# EAGLE design +6V (EAGLE 6.5.0)
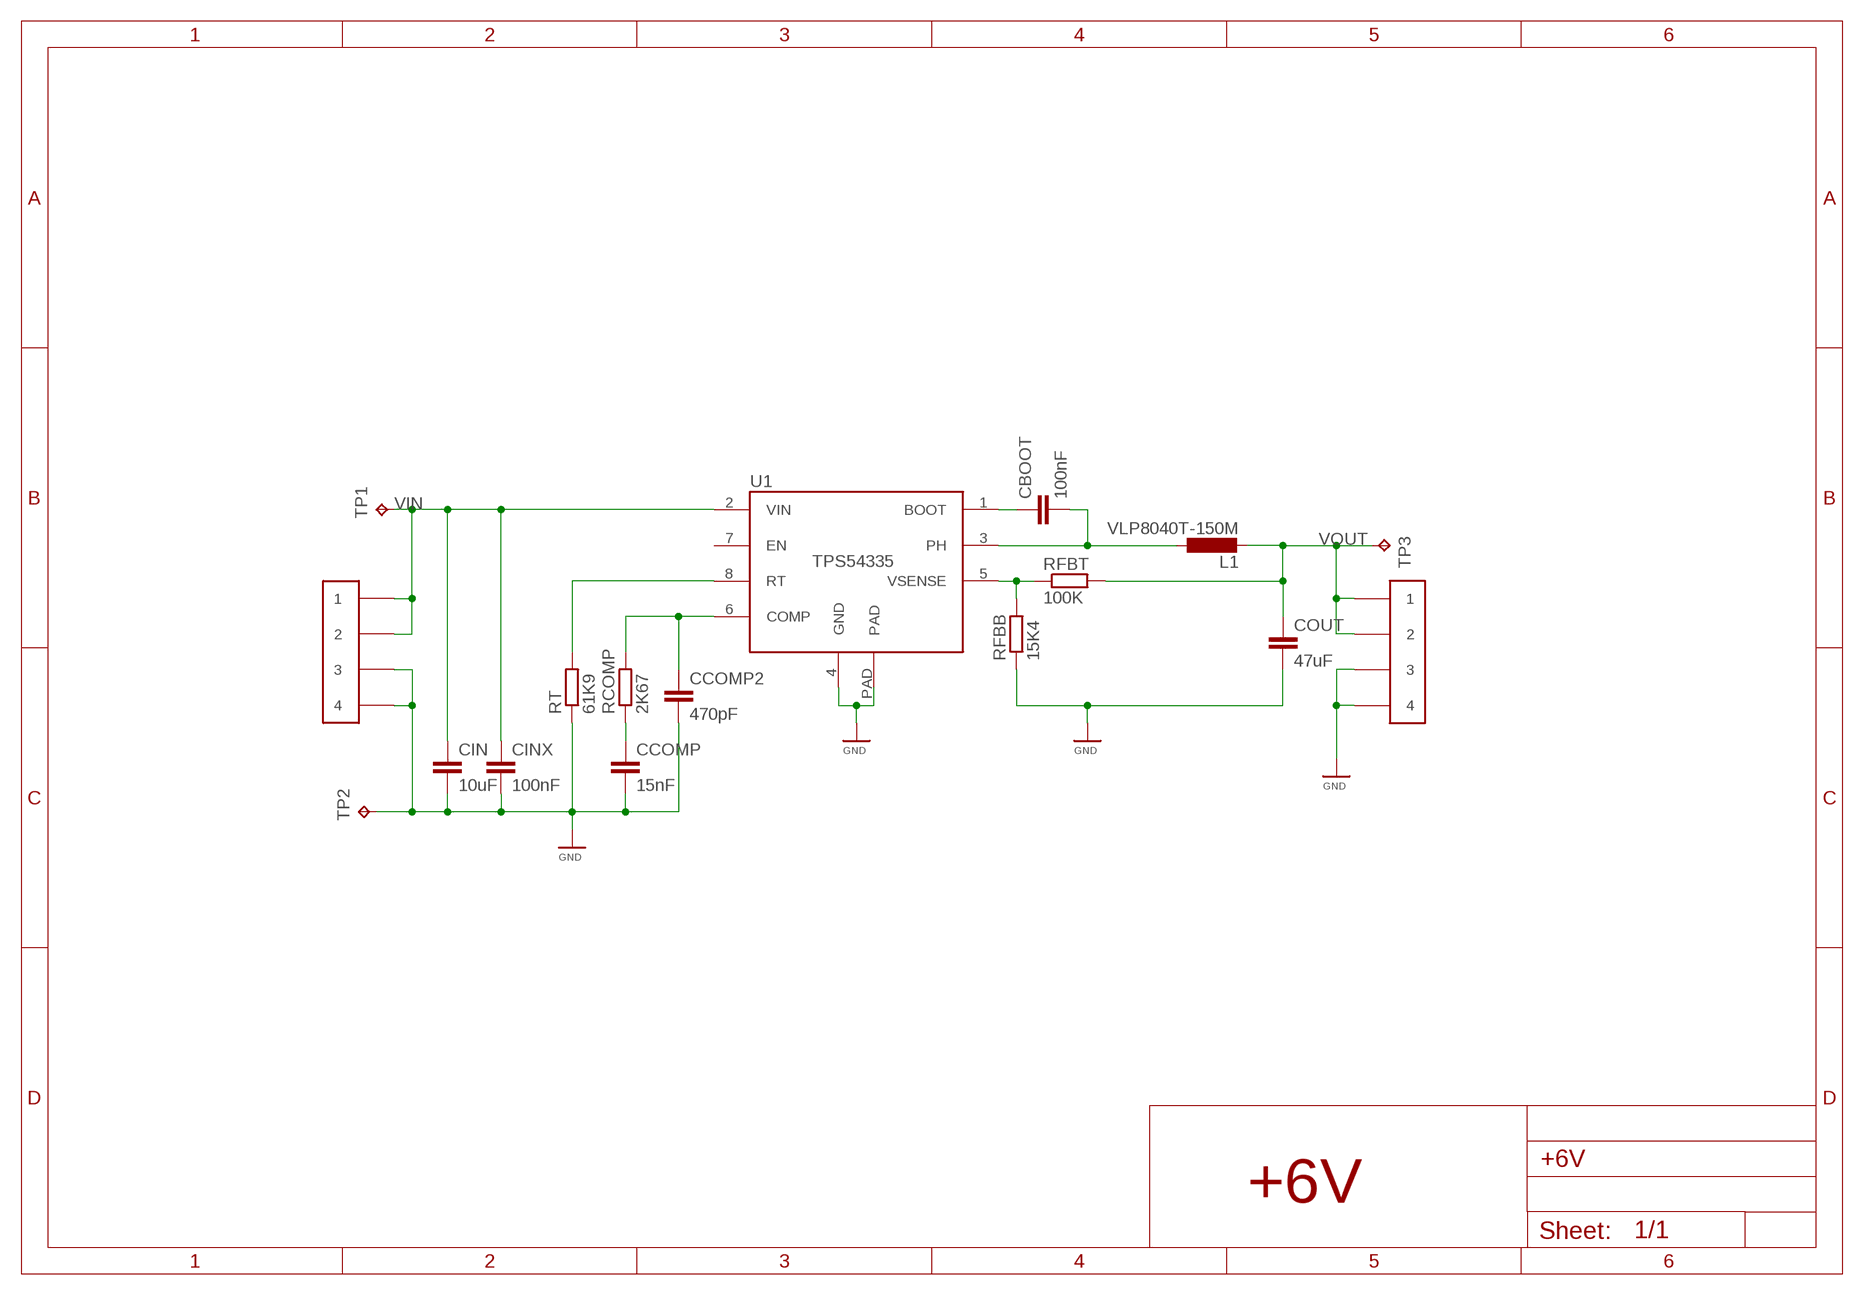
[diagram p0: schematic, sheet 1]
FRAME1 (FRAME): EXCLUDE_FROM_BOM: YES

## Parts
CBOOT  100nF  C0603  [C0603]
CCOMP  15nF  C0603  [C0603]
CCOMP2  470pF  C0603  [C0603]
CIN  10uF  C1210  [C1210]
CINX  100nF  C0603  [C0603]
COUT  47uF  C1812  [C1812]
L1  VLP8040T-150M  LTDK-VLP8040  [BOURNS-SDR1006]
RCOMP  2K67  R0603  [R0603]
RFBB  15K4  R0603  [R0603]
RFBT  100K  R0603  [R0603]
RT  61K9  R0603  [R0603]
TP1  TP  [TESTPAD]
TP2  TP  [TESTPAD]
TP3  TP  [TESTPAD]
U1  TPS54335  [TPS54335]
X1  PINCON-1X4  [PINCON-1X4]
X2  PINCON-1X4  [PINCON-1X4]

## Nets
GND: CCOMP2.2 CCOMP.2 CIN.2 CINX.2 COUT.2 RFBB.1 RT.1 TP2.P$1(TP) U1.4(GND) U1.PAD X1.P$3 X1.P$4 X2.P$3 X2.P$4
N$2: RT.2 U1.8(RT)
N$3: CCOMP2.1 RCOMP.2 U1.6(COMP)
N$4: CCOMP.1 RCOMP.1
N$7: CBOOT.2 L1.1 U1.3(PH)
N$8: CBOOT.1 U1.1(BOOT)
N$9: RFBB.2 RFBT.1 U1.5(VSENSE)
VIN: CIN.1 CINX.1 TP1.P$1(TP) U1.2(VIN) X1.P$1 X1.P$2
VOUT: COUT.1 L1.2 RFBT.2 TP3.P$1(TP) X2.P$1 X2.P$2
Unconnected: U1.7(EN)

## Notes on the sheet
- +6V

## Library data of the parts
CBOOT CCOMP CCOMP2 CINX = plr_rcl:C
CIN = plr_rcl:C; MANUFACTURER: TDK; MPN: C3225X5R1E106K; OC_DIGIKEY: 445-3946-1-ND; OC_FARNELL: 2346957; OC_MOUSER: 810-C3225X5R1E106K
COUT = plr_rcl:C; MANUFACTURER: TDK; MPN: C4532X5R1A476M; OC_DIGIKEY: 445-1440-1-ND; OC_FARNELL: 2112732; OC_MOUSER: 810-C4532X5R1A476M
L1 = plr_rcl:L; MANUFACTURER: TDK; MPN: VLP8040T-150M; OC_DIGIKEY: 445-6572-1-ND; OC_FARNELL: 2345214; OC_MOUSER: 810-VLP8040T-150M
RCOMP RFBB RFBT RT = plr_rcl:R
TP1-TP3 = plr_common:TP; EXCLUDE_FROM_BOM: YES
U1 = plr_vreg:TPS54335; MANUFACTURER: TI; MPN: TPS54335DDA; OC_DIGIKEY: 296-36208-5-ND; OC_FARNELL: 2346999; OC_MOUSER: 595-TPS54335DDA
X1 X2 = plc_con:PINCON-1X4

## Board
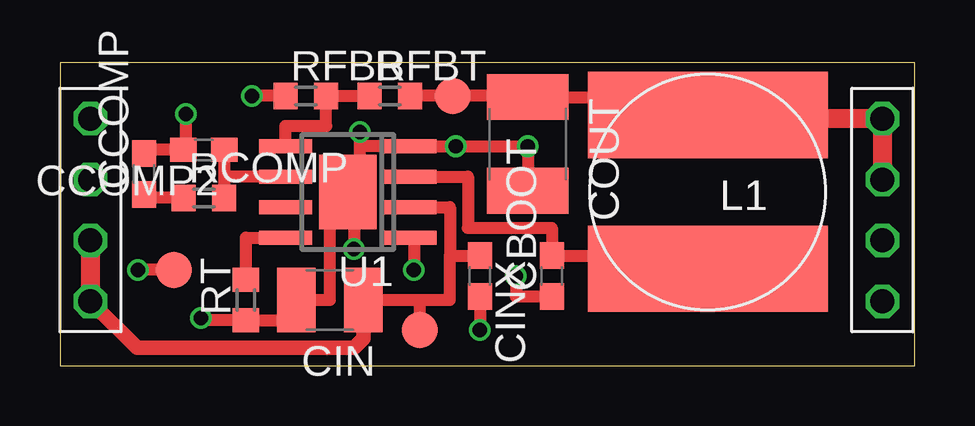
[diagram p1: board, top side]
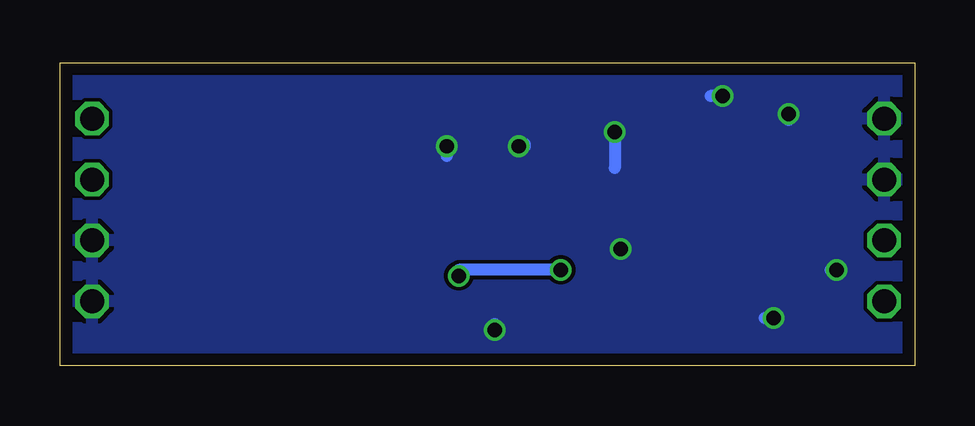
[diagram p2: board, bottom side, seen from below]

Size 35.62 x 12.62 mm. Coordinates in mm from the lower left corner, seen from the top.
Outline: 0,0 35.62,0 35.62,12.62 0,12.62 0,0
Copper layers (1*16): Top 0.035mm / dielectric 1.5mm / Bottom 0.035mm
Design rules "multi-cb_035um-cu_en *": minimum track width 6mil, minimum drill 12mil, track to track 6mil, track to pad 6mil, pad to pad 6mil, via to via 6mil, smd to smd 6mil, copper to edge 20mil, drill to drill 8mil, minimum pad ring 8mil, minimum via ring 6mil, stop-mask expansion 3mil, vias tented up to drill 0mil, thermal gap 8mil

### Footprints (pad centres in the part's own frame; a part is rotated, then mirrored left to right if it is on the bottom)
C0603 = smd 1.1 x 1: 1 -0.85,0; 2 0.85,0
C1210 = smd 1.6 x 2.7: 1 -1.4,0; 2 1.4,0
C1812 = smd 1.9 x 3.4: 1 -1.95,0; 2 1.95,0
BOURNS-SDR1006 = smd 10 x 3.6: 1 0,3.2; 2 0,-3.2
R0603 = smd 1 x 1.1: 1 -0.85,0; 2 0.85,0
TESTPAD = smd 1.5 x 1.5: P$1 0,0
TPS54335 = smd 0.6 x 2.2: 1 -1.905,-2.6; 2 -0.635,-2.6; 3 0.635,-2.6; 4 1.905,-2.6; 5 1.905,2.6; 6 0.635,2.6; 7 -0.635,2.6; 8 -1.905,2.6 | smd 3.1 x 2.4: PAD 0,0
PINCON-1X4 = drill 1 octagon: P$1 -3.81,0; P$2 -1.27,0; P$3 1.27,0; P$4 3.81,0

### Placement (x,y rotation side)
CBOOT  20.5,3.75 90 top
CCOMP  3.5,8 90 top
CCOMP2  6,9 180 top
CIN  11.25,2.75 180 top
CINX  17.5,3.75 270 top
COUT  19.5,9.25 270 top
L1  27,7.25 180 top
RCOMP  6,7 0 top
RFBB  10.25,11.25 0 top
RFBT  13.75,11.25 0 top
RT  7.75,2.75 90 top
TP1  15,1.5 0 top
TP2  4.75,4 0 top
TP3  16.38,11.25 0 top
U1  12,7.25 90 top
X1  1.27,6.5 90 top
X2  34.29,6.5 270 top

### Tracks (layer width: path | path; a pad name or v marks a point on that pad's centre or on a via)
GND  (via drill 0.6)
  Top 0.5: COUT.2 v19.5,9.15 v16.5,9.15 U1.4 12.5,9.15 | U1.PAD 11.25,7.25 11.25,2.75 CIN.2 9.85,1.9 RT.1 5.88,1.9 v5.88,2 | CINX.2 v17.5,1.5 | CCOMP.2 3.5,9 CCOMP2.2 5.25,9 v5.25,10.5 | TP2.P$1 v3.25,4 | U1.PAD 12.25,7.25 v12.25,4.88 | RFBB.1 v8,11.25 | U1.PAD 12.5,7.25 12.5,9.15 | 12.5,9.15 v12.5,9.75
  Bottom 0.5: v19.5,9.15 19.5,8.75 | v17.5,1.5 17.5,1.75 | v3.25,4 3.5,4 | v5.25,10.5 5.25,10.25 | v8,11.25 8.5,11.25 | v12.5,9.75 12.5,8.25 | v16.5,9.15 16.25,9.15 16.25,9.25 | v5.88,2 6.25,2
  pour Bottom: -1,14.25 36,14.25 36,-1 -1,-1
N$2
  Top 0.5: RT.2 7.75,5.34 U1.8
N$3
  Top 0.5: U1.6 6.85,7.88 | 6.85,7.88 RCOMP.2 | CCOMP2.1 6.85,7.88
N$4
  Top 0.5: RCOMP.1 3.5,7 CCOMP.1
N$7
  Top 0.5: U1.3 17,7.88 17,5.75 20.5,5.75 CBOOT.2 27,4.6 L1.1
N$8  (via drill 0.6)
  Top 0.5: U1.1 14.75,5.34 v14.75,4 | v19,3.75 19,2.9 CBOOT.1
  Bottom 0.5: v14.75,4 19,4 v19,3.75
N$9
  Top 0.5: RFBT.1 RFBB.2 11.1,10 9.4,10 U1.5
VIN
  Top 0.5: U1.2 16.25,6.62 16.25,4.6 | 16.25,4.6 CINX.1 | CIN.1 15,2.75 | 15,2.75 16.25,2.75 16.25,4.6 | TP1.P$1 15,2.75
  Top 0.6: CIN.1 12.65,1.15 12.25,0.75 3.21,0.75 X1.P$1
  Top 0.8: X1.P$2 X1.P$1
VOUT
  Top 0.5: L1.2 27,11.2 COUT.1 19.5,11.25 TP3.P$1 RFBT.2
  Top 0.8: X2.P$2 X2.P$1 27.14,10.31 L1.2